# Altium schematic sheet SP1_TYPEC_PWR_IN.SchDoc
size A4; Date: 07.08.2025; CheckedBy: Own Check; CompanyName: No Company; DocumentNumber: ELK.PCB.0005.0005.A.A; Revision: V0.0.1; SheetNumber: 20; SheetTotal: 22
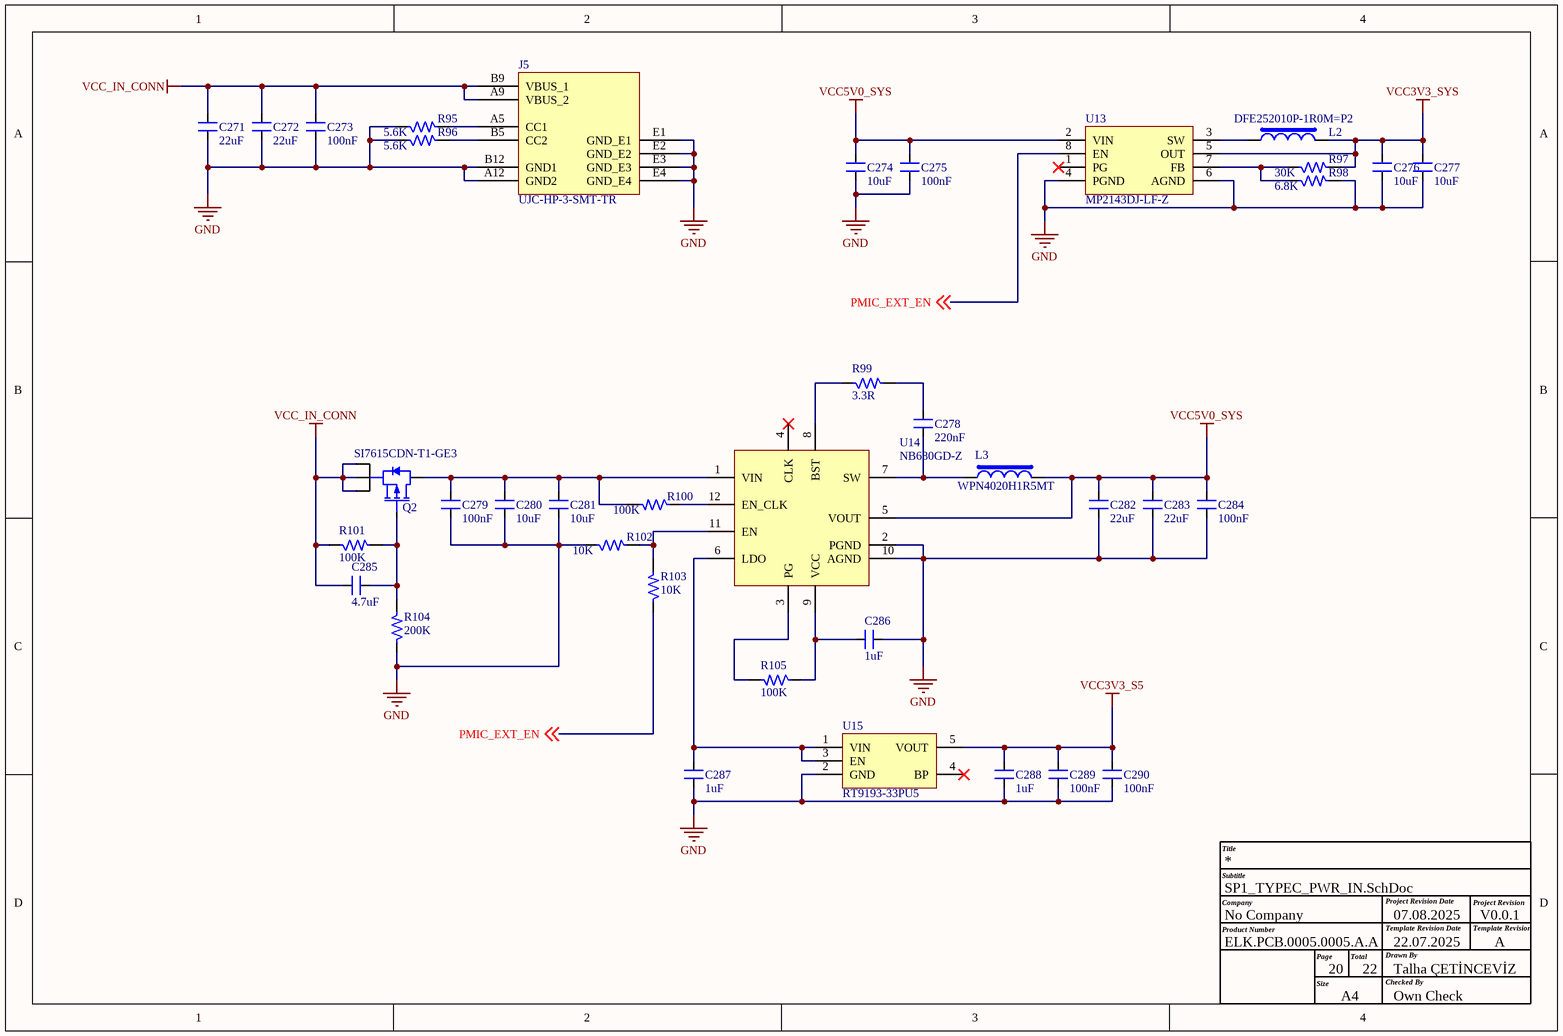
[diagram p0: SP1_TYPEC_PWR_IN.SchDoc]

## Parts
C271  22uF  [CAP_0603]
C272  22uF  [CAP_0603]
C273  100nF  [CAP_0402]
C274  10uF  [CAP_0402]
C275  100nF  [CAP_0402]
C276  10uF  [CAP_0402]
C277  10uF  [CAP_0402]
C278  220nF  [CAP_0402]
C279  100nF  [CAP_0402]
C280  10uF  [CAP_0402]
C281  10uF  [CAP_0402]
C282  22uF  [CAP_0603]
C283  22uF  [CAP_0603]
C284  100nF  [CAP_0402]
C285  4.7uF  [CAP_0402]
C286  1uF  [CAP_0402]
C287  1uF  [CAP_0402]
C288  1uF  [CAP_0402]
C289  100nF  [CAP_0402]
C290  100nF  [CAP_0402]
J5  UJC-HP-3-SMT-TR  [CON6_48.4_UJC-HP-3-SMT-TR]
L2  DFE252010P-1R0M=P2  [IND_1008]
L3  WPN4020H1R5MT  [IND_1616]
Q2  SI7615CDN-T1-GE3  [PowerPAK_1212-8_SMD]
R95  5.6K  [RES_0402]
R96  5.6K  [RES_0402]
R97  30K  [RES_0402]
R98  6.8K  [RES_0402]
R99  3.3R  [RES_0402]
R100  100K  [RES_0402]
R101  100K  [RES_0402]
R102  10K  [RES_0402]
R103  10K  [RES_0402]
R104  200K  [RES_0402]
R105  100K  [RES_0402]
U13  MP2143DJ-LF-Z  [SOT23-8]
U14  NB680GD-Z  [QFN-12_19_118X118_SMD]
U15  RT9193-33PU5  [SC70-5]

## Nets
GND: C271.1 C272.1 C273.1 C274.1 C275.1 C276.1 C277.1 C279.1 C280.1 C281.1 C282.1 C283.1 C284.1 C286.1 C287.1 C288.1 C289.1 C290.1 J5.A12(GND2) J5.B12(GND1) J5.E1(GND_E1) J5.E2(GND_E2) J5.E3(GND_E3) J5.E4(GND_E4) R95.1 R96.1 R98.2 R102.1 R104.1 U13.4(PGND) U13.6(AGND) U14.2(PGND) U14.10(AGND) U15.2(GND)
VCC3V3_S5: C288.2 C289.2 C290.2 U15.5(VOUT)
VCC3V3_SYS: C276.2 C277.2 L2.2 R97.2 U13.5(OUT)
VCC5V0_SYS: C274.2 C275.2 C282.2 C283.2 C284.2 L3.2 U13.2(VIN) U14.5(VOUT)
VCC_IN_CONN: C271.2 C272.2 C273.2 C285.1 J5.A9(VBUS_2) J5.B9(VBUS_1) Q2.1(S) Q2.2(S) Q2.3(S) R101.1
PMIC_EXT_EN: R103.1 U13.8(EN) ; off-sheet PMIC_EXT_EN
NetC278_1: C278.1 L3.1 U14.7(SW)
NetC278_2: C278.2 R99.2
NetC279_2: C279.2 C280.2 C281.2 Q2.5(D) R100.2 U14.1(VIN)
NetC285_2: C285.2 Q2.4(G) R101.2 R104.2
NetC286_2: C286.2 R105.1 U14.9(VCC)
NetC287_2: C287.2 U14.6(LDO) U15.1(VIN) U15.3(EN)
NetJ5_A5: J5.A5(CC1) R95.2
NetJ5_B5: J5.B5(CC2) R96.2
NetL2_1: L2.1 U13.3(SW)
NetR97_1: R97.1 R98.1 U13.7(FB)
NetR99_1: R99.1 U14.8(BST)
NetR100_1: R100.1 U14.12(EN_CLK)
NetR102_2: R102.2 R103.2 U14.11(EN)
NetR105_2: R105.2 U14.3(PG)

Not connected (* = marked no-connect by the designer): U13 1(PG)*; U14 4(CLK)*; U15 4(BP)*

## Notes on the sheet
- Title
- Company
- Product Number
- Subtitle
- Project Revision Date
- Template Revision Date
- Project Revision
- Template Revision
- Size
- Page
- A4
- Total
- Checked By
- Drawn By
- 22.07.2025
- Talha ÇETİNCEVİZ
- A

## Library data of the parts
C271 C272 C282 C283 = CAP_22uF-10V-20%-0603: 22µF ±20% 10V Ceramic Capacitor X5R 0603 (1608 Metric); Manufacturer: Murata Electronics; Manufacturer Part Number: GRM188R61A226ME15D; Case/Package: 0603; Supplier-1: Digikey
C273 C275 C279 C284 C289 C290 = CAP_100nF-25V-10%-0402: 0.1µF ±10% 25V Ceramic Capacitor X7R 0402 (1005 Metric); Manufacturer: Walsin Technology Corporation; Manufacturer Part Number: 0402B104K250CT; Case/Package: 0402; Supplier-1: Digikey
C274 C276 C277 C280 C281 = CAP_10uF-10V-20%-0402: 10µF ±20% 10V Ceramic Capacitor X5R 0402 (1005 Metric); Manufacturer Part Number: CL05A106MP5NUNC; Manufacturer: Samsung Electro-Mechanics; Case/Package: 0402; Supplier-1: Digikey
C278 = CAP_220nF-10V-10%-0402: 0.22µF ±10% 10V Ceramic Capacitor X7R 0402 (1005 Metric); Manufacturer: Samsung Electro-Mechanics; Manufacturer Part Number: CL05B224KP5NNNC; Case/Package: 0402; Supplier-1: Digikey
C285 = CAP_4.7uF-10V-10%-0402: 4.7µF ±10% 10V Ceramic Capacitor X5R 0402 (1005 Metric); Manufacturer: Samsung Electro-Mechanics; Manufacturer Part Number: CL05A475KP5NRNC; Case/Package: 0402; Supplier-1: Digikey
C286-C288 = CAP_1uF-16V-10%-0402: 1µF ±10% 16V Ceramic Capacitor X5R 0402 (1005 Metric); Manufacturer: Knowles Novacap; Manufacturer Part Number: 0402BW105K160YT; Case/Package: 0402; Supplier-1: Digikey
J5 = CON-TYPEC_6X1-100-RA-TH: USB Connectors USB jack, C type, power only, 6 pin, horizonal, gold flash plating, surface mount, T&R; Manufacturer: CUI Devices; Manufacturer Part Number: UJC-HP-3-SMT-TR; Case/Package: TH; Supplier-1: Mouser
L2 = IND_1uH-3.8A-20%-1008: 1µH Shielded Wirewound Inductor 3.8A 54mOhm Max 1008 (2520 Metric); Manufacturer: Murata Electronics; Manufacturer Part Number: DFE252010P-1R0M=P2; Case/Package: 1008; Supplier-1: Digikey
L3 = IND_1.5uH-6A-20%-SMD: Wire Wound SMD Power Inductors – WPN Series / Operating Temp. : -40℃~+125℃ (Including self-heating); Manufacturer: Sunlord; Mnaufcaturer Part Number: WPN4020H1R5MT; Case/Package: SMD; Supplier-1: NA
Q2 = MOSFET-P_20V-35A-1212-8: P-Channel 20V 35A (Tc) 33W (Tc) Surface Mount PowerPAK® 1212-8; Manufacturer: Vishay Siliconix; Manufacturer Part Number: SI7615CDN-T1-GE3; Case/Package: PowerPAK® 1212-8; Supplier-1: Digikey
R95 R96 = RES_5.6K-0.1W-1%-0402: 5.6 kOhms ±1% 0.1W, 1/10W Chip Resistor 0402 (1005 Metric) Automotive AEC-Q200, Moisture Resistant Thick Film; Manufacturer: KOA Speer Electronics, Inc.; Manufacturer Part Number: RK73H1ETTP5601F; Case/Package: 0402; Supplier-1: Digikey
R97 = RES_30K-0.1W-1%-0402: 30 kOhms ±1% 0.1W, 1/10W Chip Resistor 0402 (1005 Metric) Automotive AEC-Q200, Moisture Resistant Thick Film; Manufacturer: KOA Speer Electronics, Inc.; Manufacturer Part Number: RK73H1ETTP3002F; Case/Package: 0402; Supplier-1: Digikey
R98 = RES_6.8K-0.1W-1%-0402: 6.8 kOhms ±1% 0.1W, 1/10W Chip Resistor 0402 (1005 Metric) Anti-Sulfur Thin Film; Manufacturer: Vishay Beyschlag/Draloric/BC Components; Manufacturer Part Number: MCS04020C6801FE000; Supplier-1: Digikey; Case/Package: 0402
R99 = RES_3.3R-0.1W-1%-0402: 3.3 Ohms ±1% 0.1W, 1/10W Chip Resistor 0402 (1005 Metric) Anti-Sulfur, Automotive AEC-Q200 Thick Film; Manufacturer: Panasonic Electronic Components; Manufacturer Part Number: ERJ-U02F3R30X; Case/Package: 0402; Supplier-1: Digikey
R100 R101 R105 = RES_100K-0.1W-1%-0402: 100 kOhms ±1% 0.1W, 1/10W Chip Resistor 0402 (1005 Metric) Anti-Sulfur Thin Film; Manufacturer: Vishay Beyschlag/Draloric/BC Components; Manufacturer Part Number: MCS04020C1003FE000; Case/Package: 0402; Supplier-1: Digikey
R102 R103 = RES_10K-0.1W-1%-0402: 10 kOhms ±1% 0.1W, 1/10W Chip Resistor 0402 (1005 Metric) Anti-Sulfur Thin Film; Manufacturer: Vishay Beyschlag/Draloric/BC Components; Manufacturer Part Number: MCS04020C1002FE000; Case/Package: 0402; Supplier-1: Digikey
R104 = RES_200K-0.1W-1%-0402: 200 kOhms ±1% 0.1W, 1/10W Chip Resistor 0402 (1005 Metric) Automotive AEC-Q200 Thick Film; Manufacturer: Panasonic Electronic Components; Manufacturer Part number: ERJ-2RKF2003X; Case/Package: 0402; Supplier-1: Digikey
U13 = REG_0.6~5V-5.5V-3A-TSOT-23-8: Switching Voltage Regulators 3A, 5.5V, 1.2MHz Sync Stp-Dwn Swtchr; Manufacturer: Monolithic Power Systems (MPS); Manufacturer Part Number: MP2143DJ-LF-Z; Case/Package: TSOT-23-8; Supplier-1: Mouser
U14 = REG_3.3V-26V-8A-QFN-12: Switching Voltage Regulators 26V Fixed 3.3 V-8A Sync Buck Converter; Manufacturer: Monolithic Power Systems (MPS); Manufacturer Part Number: NB680GD-Z; Case/Package: QFN-12; Supplier-1: Mouser
U15 = REG_3.3V-5.5V-300mA-SC-70-5: SC-70-5 Dropout Regulators(LDO) RoHS; Manufacturer: Richtek Tech; Manufacturer Part Number: RT9193-33PU5; Case/Package: SC-70-5; Supplier-1: LCSC